# Altium schematic sheet USB3.SchDoc: USB3
size A3; Date: Not used; ApprovedBy: Not used; CheckedBy: Not used; Author: Not used; CompanyName: STMicroelectronics; DrawnBy: Not used; Engineer: Not used; Organization: Not used; Address1: Not used; Address2: Not used; Address3: Not used; Address4: Not used; DocumentNumber: Not used; Revision: Not used; SheetNumber: 13; SheetTotal: 18; CurrentTime: Not used; CurrentDate: Not used; Time: Not used; DocumentFullPathAndName: Not used; DocumentName: Not used; ModifiedDate: Not used; ImagePath: Not used; ProjectName: Not used; Application_BuildNumber: Not used
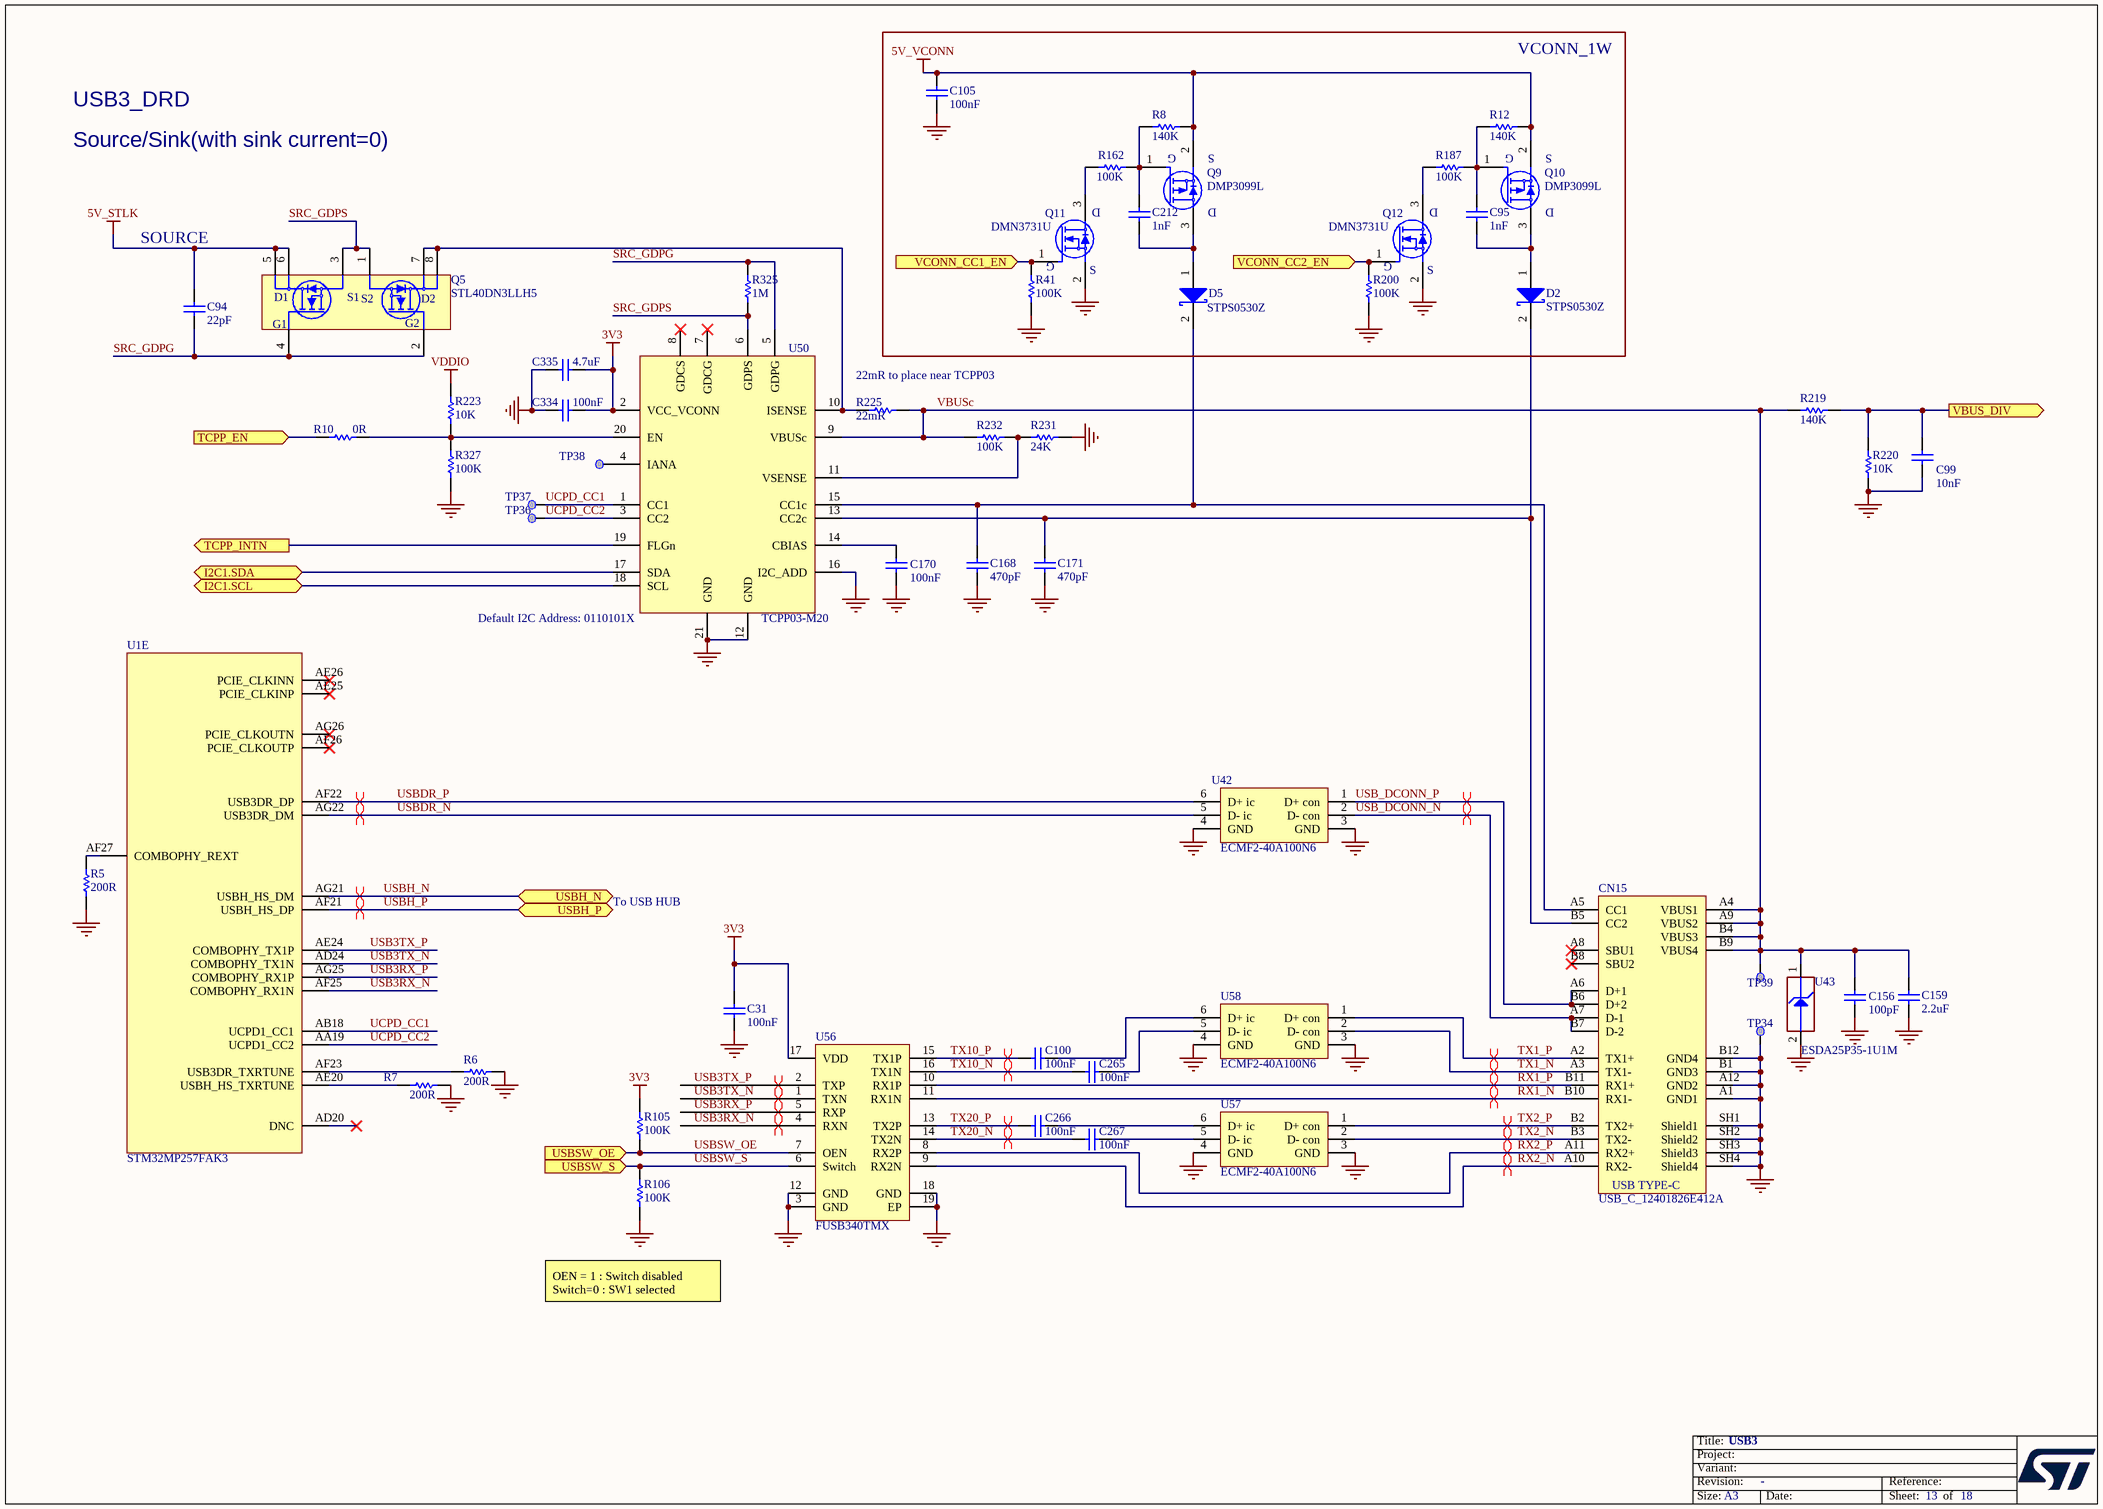
[diagram p0: USB3.SchDoc]

## Parts
C31  value 100nF  [C0402]  (hidden comment: Capacitor)
C94  value 22pF  [C0402]  (hidden comment: Capacitor)
C95  value 1nF  [C0402]  (hidden comment: Capacitor)
C99  value 10nF  [C0402]  (hidden comment: Capacitor)
C100  value 100nF  [C0201_H0P3]  (hidden comment: Capacitor)
C105  value 100nF  [C0402]  (hidden comment: Capacitor)
C156  value 100pF  [C0402]  (hidden comment: Capacitor)
C159  value 2.2uF  [C0805]  (hidden comment: Capacitor)
C168  value 470pF  [C0402]  (hidden comment: Capacitor)
C170  value 100nF  [C0603]  (hidden comment: Capacitor)
C171  value 470pF  [C0402]  (hidden comment: Capacitor)
C212  value 1nF  [C0402]  (hidden comment: Capacitor)
C265  value 100nF  [C0201_H0P3]  (hidden comment: Capacitor)
C266  value 100nF  [C0201_H0P3]  (hidden comment: Capacitor)
C267  value 100nF  [C0201_H0P3]  (hidden comment: Capacitor)
C334  value 100nF  [C0402]  (hidden comment: Capacitor)
C335  value 4.7uF  [C0402]  (hidden comment: Capacitor)
CN15  value USB_C_12401826E412A  [CON_USB-TYPEC_AMPHENOL_12401826E412A]  (hidden comment: USB_TYPE_C_Receptacle)
D2  value STPS0530Z  [DIO_SOD123_1A_2K_H1P45]  (hidden comment: SCHOTTKY_1A_2K)
D5  value STPS0530Z  [DIO_SOD123_1A_2K_H1P45]  (hidden comment: SCHOTTKY_1A_2K)
Q5  STL40DN3LLH5  [PowerFLAT_5x6]
Q9  value DMP3099L  [MOS_SOT23]  (hidden comment: MOSFET_P-CHANNEL)
Q10  value DMP3099L  [MOS_SOT23]  (hidden comment: MOSFET_P-CHANNEL)
Q11  value DMN3731U  [MOS_SOT23]  (hidden comment: MOSFET_N-CHANNEL)
Q12  value DMN3731U  [MOS_SOT23]  (hidden comment: MOSFET_N-CHANNEL)
R5  value 200R  [R0402]  (hidden comment: Resistor)
R6  value 200R  [R0402]  (hidden comment: Resistor)
R7  value 200R  [R0402]  (hidden comment: Resistor)
R8  value 140K  [R0402]  (hidden comment: Resistor)
R10  value 0R  [R0402]  (hidden comment: Resistor)
R12  value 140K  [R0402]  (hidden comment: Resistor)
R41  value 100K  [R0402]  (hidden comment: Resistor)
R105  value 100K  [R0402]  (hidden comment: Resistor)
R106  value 100K  [R0402]  (hidden comment: Resistor)
R162  value 100K  [R0402]  (hidden comment: Resistor)
R187  value 100K  [R0402]  (hidden comment: Resistor)
R200  value 100K  [R0402]  (hidden comment: Resistor)
R219  value 140K  [R0402]  (hidden comment: Resistor)
R220  value 10K  [R0402]  (hidden comment: Resistor)
R223  value 10K  [R0402]  (hidden comment: Resistor)
R225  value 22mR  [R0603]  (hidden comment: Resistor)
R231  value 24K  [R0402]  (hidden comment: Resistor)
R232  value 100K  [R0402]  (hidden comment: Resistor)
R325  value 1M  [R0402]  (hidden comment: Resistor)
R327  value 100K  [R0402]  (hidden comment: Resistor)
TP34  Test Point  [TP_SMD_1MM]  (value not drawn)  (no BOM)
TP36  Test Point  [TP_SMD_1MM]  (value not drawn)  (no BOM)
TP37  Test Point  [TP_SMD_1MM]  (value not drawn)  (no BOM)
TP38  Test Point  [TP_SMD_1MM]  (value not drawn)  (no BOM)
TP39  Test Point  [TP_SMD_1MM]  (value not drawn)  (no BOM)
U1  STM32MP257FAK3  [ICC_TFBGA424_14X14_P050_H1P20_CODE-B0A2]  (part E of 9)
U42  ECMF2-40A100N6  [ESD_UQFN-6L_1P45X1P4_P040]
U43  value ESDA25P35-1U1M  [ESD_QFN1610_2N_1K_2A]  (hidden comment: ESD-TRANSIL)
U50  TCPP03-M20  [ICC_QFN20-EPAD_4X4_P050]
U56  FUSB340TMX  [ICC_UQFN18-EPAD_2X2P80_P040]
U57  ECMF2-40A100N6  [ESD_UQFN-6L_1P45X1P4_P040]
U58  ECMF2-40A100N6  [ESD_UQFN-6L_1P45X1P4_P040]

## Blocks framed on the sheet
VCONN_1W: C95 C105 C212 D2 D5 Q9-Q12 R8 R12 R41 R162 R187 R200

## Ports
I2C1.SCL (bidir), I2C1.SDA (bidir), TCPP_EN (in), TCPP_INTN (out), USBH_N (bidir), USBH_P (bidir), USBSW_OE (in), USBSW_S (in), VBUS_DIV (out), VCONN_CC1_EN (in), VCONN_CC2_EN (in)

## Nets
3V3: C31.1 C334.1 C335.1 R105.2 U50.2(VCC_VCONN) U56.17(VDD)
5V_STLK: C94.2 Q5.5(D1) Q5.6(D1)
5V_VCONN: C105.1 Q9.2(S) Q10.2(S) R8.2 R12.2
GND: C31.2 C99.2 C105.2 C156.1 C159.1 C168.1 C170.1 C171.1 C334.2 C335.2 CN15.A1(GND1) CN15.A12(GND2) CN15.B1(GND3) CN15.B12(GND4) CN15.SH1(Shield1) CN15.SH2(Shield2) CN15.SH3(Shield3) CN15.SH4(Shield4) Q11.2(S) Q12.2(S) R5.1 R6.2 R7.2 R41.1 R106.1 R200.1 R220.1 R231.2 R327.1 TP34.1 U42.3(GND) U42.4(GND) U43.2(GND) U50.12(GND) U50.16(I2C_ADD) U50.21(GND) U56.3(GND) U56.12(GND) U56.18(GND) U56.19(EP) U57.3(GND) U57.4(GND) U58.3(GND) U58.4(GND)
VDDIO: R223.2
I2C1.SCL: U50.18(SCL) ; port I2C1.SCL
I2C1.SDA: U50.17(SDA) ; port I2C1.SDA
RX1_N: CN15.B10(RX1-) U56.11(RX1N)
RX1_P: CN15.B11(RX1+) U56.10(RX1P)
RX2_N: CN15.A10(RX2-) U56.9(RX2N)
RX2_P: CN15.A11(RX2+) U56.8(RX2P)
SRC_GDPG: C94.1 Q5.2(G2) Q5.4(G1) R325.2 U50.5(GDPG)
SRC_GDPS: Q5.1(S2) Q5.3(S1) R325.1 U50.6(GDPS)
TCPP_EN: R10.1 ; port TCPP_EN
TCPP_INTN: U50.19(FLGn) ; port TCPP_INTN
TX1_N: CN15.A3(TX1-) U58.2(D-_con)
TX1_P: CN15.A2(TX1+) U58.1(D+_con)
TX2_N: CN15.B3(TX2-) U57.2(D-_con)
TX2_P: CN15.B2(TX2+) U57.1(D+_con)
TX10_N: C265.1 U56.16(TX1N)
TX10_P: C100.1 U56.15(TX1P)
TX20_N: C267.1 U56.14(TX2N)
TX20_P: C266.1 U56.13(TX2P)
UCPD_CC1: TP37.1 U1.AB18(UCPD1_CC1) U50.1(CC1)
UCPD_CC2: TP36.1 U1.AA19(UCPD1_CC2) U50.3(CC2)
USB3RX_N: U1.AF25(COMBOPHY_RX1N) U56.4(RXN)
USB3RX_P: U1.AG25(COMBOPHY_RX1P) U56.5(RXP)
USB3TX_N: U1.AD24(COMBOPHY_TX1N) U56.1(TXN)
USB3TX_P: U1.AE24(COMBOPHY_TX1P) U56.2(TXP)
USB_DCONN_N: CN15.A7(D-1) CN15.B7(D-2) U42.2(D-_con)
USB_DCONN_P: CN15.A6(D+1) CN15.B6(D+2) U42.1(D+_con)
USBDR_N: U1.AG22(USB3DR_DM) U42.5(D-_ic)
USBDR_P: U1.AF22(USB3DR_DP) U42.6(D+_ic)
USBH_N: U1.AG21(USBH_HS_DM) ; port USBH_N
USBH_P: U1.AF21(USBH_HS_DP) ; port USBH_P
USBSW_OE: R105.1 U56.7(OEN) ; port USBSW_OE
USBSW_S: R106.2 U56.6(Switch) ; port USBSW_S
VBUS_DIV: C99.1 R219.1 R220.2 ; port VBUS_DIV
VBUSc: C156.2 C159.2 CN15.A4(VBUS1) CN15.A9(VBUS2) CN15.B4(VBUS3) CN15.B9(VBUS4) R219.2 R225.1 R232.1 TP39.1 U43.1(IO1) U50.9(VBUSc)
VCONN_CC1_EN: Q11.1(G) R41.2 ; port VCONN_CC1_EN
VCONN_CC2_EN: Q12.1(G) R200.2 ; port VCONN_CC2_EN
NetC95_1: C95.1 D2.1(A) Q10.3(D)
NetC95_2: C95.2 Q10.1(G) R12.1 R187.2
NetC100_2: C100.2 U58.6(D+_ic)
NetC168_2: C168.2 CN15.A5(CC1) D5.2(K) U50.15(CC1c)
NetC170_2: C170.2 U50.14(CBIAS)
NetC171_2: C171.2 CN15.B5(CC2) D2.2(K) U50.13(CC2c)
NetC212_1: C212.1 D5.1(A) Q9.3(D)
NetC212_2: C212.2 Q9.1(G) R8.1 R162.2
NetC265_2: C265.2 U58.5(D-_ic)
NetC266_2: C266.2 U57.6(D+_ic)
NetC267_2: C267.2 U57.5(D-_ic)
NetQ5_7: Q5.7(D2) Q5.8(D2) R225.2 U50.10(ISENSE)
NetQ11_3: Q11.3(D) R162.1
NetQ12_3: Q12.3(D) R187.1
NetR5_2: R5.2 U1.AF27(COMBOPHY_REXT)
NetR6_1: R6.1 U1.AF23(USB3DR_TXRTUNE)
NetR7_1: R7.1 U1.AE20(USBH_HS_TXRTUNE)
NetR10_2: R10.2 R223.1 R327.2 U50.20(EN)
NetR231_1: R231.1 R232.2 U50.11(VSENSE)
NetTP38_1: TP38.1 U50.4(IANA)

Not connected (* = marked no-connect by the designer): CN15 A8(SBU1)* B8(SBU2)*; U1 AD20(DNC)* AE25(PCIE_CLKINP)* AE26(PCIE_CLKINN)* AF26(PCIE_CLKOUTP)* AG26(PCIE_CLKOUTN)*; U50 7(GDCG)* 8(GDCS)*

## Layout directives
differential pair: RX1_N, RX1_P, RX2_N, RX2_P, TX1_N, TX1_P, TX2_N, TX2_P, TX10_N, TX10_P, TX20_N, TX20_P, USB3RX_N, USB3RX_P, USB3TX_N, USB3TX_P, USB_DCONN_N, USB_DCONN_P, USBDR_N, USBDR_P, USBH_N, USBH_P

## Notes on the sheet
- USB3_DRD
- Source/Sink(with sink current=0)
- SOURCE
- 22mR to place near TCPP03
- (near U50) Default I2C Address: 0110101X
- To USB HUB
- OEN = 1 : Switch disabled
  Switch=0 : SW1 selected
- Title:
- Project:
- Size:
- Revision:
- Variant:
- A3
- -
- Date:
- Reference:
- Sheet:
- of
- (in symbol MCD-03232) USB TYPE-C

## Library data of the parts
C31 C105 C334 = MCD-00006: Capacitor, MLCC, 100nF, 16V, X7R, +/-10%, 0402, T=0.5mm; Part_Preference: Recommended; Manufacturer: YAGEO; Manufacturer_Part_Number: CC0402KRX7R7BB104; Partial_Alternate_Internal_Part_Number: MCD-03299; Order_Code_RS: 616-9701; Component_Country_Of_Origin: China; Alternate_EMS: M; ID: 2474; ShowFields: YES; Internal_Part_Number: MCD-00006; Status: Released; Part_Type: Capacitor; Package: 0402; ComponentLink1URL: http://tunmcdsvn.tun.st.com/Component_Documentation_Library/Trunk/Capacitor/YAGEO_X7R_Series; Order_Code_Digikey: 311-1338-1-ND; Order_Code_Farnell: 9402047
C94 = MCD-01995: Capacitor, MLCC, 22pF, 50V, C0G, +/-5%, 0402, T=0.5mm; Part_Preference: Recommended; Manufacturer: TDK; Manufacturer_Part_Number: C1005NP01H220J050BA; Component_Country_Of_Origin: Unknown; ID: 4095; ShowFields: YES; Internal_Part_Number: MCD-01995; Status: Released; Part_Type: Capacitor; Package: 0402; ComponentLink1URL: http://tunmcdsvn.tun.st.com/Component_Documentation_Library/Trunk/Capacitor/TDK_C_Series; Order_Code_Digikey: 445-13793-1-ND; Order_Code_Farnell: 3416050RL; Order_Code_RS: N/A
C95 C212 = MCD-00198: Capacitor, MLCC, 1nF, 16V, X7R, +/-10%, 0402, T=0.5mm; Part_Preference: Recommended; Manufacturer: YAGEO; Manufacturer_Part_Number: CC0402KRX7R7BB102; Component_Country_Of_Origin: China; ShowFields: YES; ID: 2665; Internal_Part_Number: MCD-00198; Status: Released; Part_Type: Capacitor; Package: 0402; ComponentLink1URL: http://tunmcdsvn.tun.st.com/Component_Documentation_Library/Trunk/Capacitor/YAGEO_X7R_Series; Order_Code_Digikey: 311-1352-1-ND; Order_Code_Farnell: 2370642; Order_Code_RS: N/A
C99 = MCD-00011: Capacitor, MLCC, 10nF, 16V, X7R, 10%, 0402, T=0.5mm; Manufacturer_Part_Number: CC0402KRX7R7BB103; Manufacturer: YAGEO; Part_Preference: Recommended; Provided_By: SUBCO; Initial_Board_Reference: MB1274; Order_Code_RS: 669-8688; Internal_Part_Number: MCD-00011; Status: Released; Part_Type: Capacitor; Package: 0402; ComponentLink1Description: Datasheet; ComponentLink1URL: http://tunmcdsvn.tun.st.com/Component_Documentation_Library/Trunk/Capacitor/YAGEO_X7R_Series; ECCN_US: n/a; ECCN_EU: n/a; Alternate_Manufacturer: N/A; Alternate_Manufacturer_Part_Number: N/A; Order_Code_Digikey: 311-1042-1-ND; Order_Code_Farnell: 3019275
C100 C265-C267 = MCD-00697: Capacitor, MLCC, 100nF,10V, X5R, +/-10%, 0201, T=0.3mm; Part_Preference: Recommended; Manufacturer: TDK; Manufacturer_Part_Number: C0603X5R1A104K030BC; Component_Country_Of_Origin: Unknown; ID: 3046; ShowFields: YES; Internal_Part_Number: MCD-00697; Status: Released; Part_Type: Capacitor; Alternate_Manufacturer: N/A; Alternate_Manufacturer_Part_Number: N/A; Package: 0201; ComponentLink1URL: http://tunmcdsvn.tun.st.com/Component_Documentation_Library/Trunk/Capacitor/TDK_MCC_Series; Order_Code_Digikey: 445-7318-1-ND; Order_Code_Farnell: 2524957; Order_Code_RS: N/A
C156 = MCD-00205: Capacitor, MLCC, 100pF, 50V, NPO, +/-5%, 0402, T=0.5mm; Manufacturer_Part_Number: CC0402JRNPO9BN101; Manufacturer: YAGEO; Part_Preference: Recommended; Component_Country_Of_Origin: China; ID: 2658; ShowFields: YES; Internal_Part_Number: MCD-00205; Status: Released; Part_Type: Capacitor; Package: 0402; ComponentLink1URL: http://tunmcdsvn.tun.st.com/Component_Documentation_Library/Trunk/Capacitor/YAGEO_NP0_Series; Order_Code_Digikey: 311-1024-1-ND; Order_Code_Farnell: 3019226RL; Order_Code_RS: N/A
C159 = MCD-02372: Capacitor, MLCC, 2.2uF, 25V, X7R, +/-10%, 0805, T=1,25mm; Part_Preference: Recommended; Manufacturer: MURATA; Manufacturer_Part_Number: GRM21BR71E225KE11L; Component_Country_Of_Origin: Japan; ID: 4478; ShowFields: YES; Internal_Part_Number: MCD-02372; Status: Released; Part_Type: Capacitor; Package: 0805; ComponentLink1URL: http://tunmcdsvn.tun.st.com/Component_Documentation_Library/Trunk/Capacitor/MURATA_GRM_Series/GRM21BR71E225KE11; Order_Code_Digikey: 490-14467; Order_Code_Farnell: 2688538; Order_Code_RS: N/A
C168 C171 = MCD-00724: Capacitor, MLCC, 470pF, 50V, NPO, +/-5%, 0402, T=0.5mm; Manufacturer_Part_Number: CC0402JRNPO9BN471; Manufacturer: YAGEO; Part_Preference: Recommended; Component_Country_Of_Origin: China; Order_Code_RS: 199-2186; ID: 3023; ShowFields: YES; Internal_Part_Number: MCD-00724; Status: Released; Part_Type: Capacitor; Package: 0402; ComponentLink1URL: http://tunmcdsvn.tun.st.com/Component_Documentation_Library/Trunk/Capacitor/YAGEO_NP0_Series; Order_Code_Digikey: 311-1671-1-ND; Order_Code_Farnell: 3366416
C170 = MCD-01099: Capacitor, MLCC, 100nF, 50V, X7R, +/-10%, 0603, T=0.8mm; BMS_Part_Number: 9142278; Part_Preference: Recommended; Manufacturer: YAGEO; Manufacturer_Part_Number: CC0603KRX7R9BB104; Order_Code_RS: 669-8767; Component_Country_Of_Origin: China; ID: 3397; ShowFields: YES; Internal_Part_Number: MCD-01099; Status: Released; Part_Type: Capacitor; Package: 0603; ComponentLink1URL: http://tunmcdsvn.tun.st.com/Component_Documentation_Library/Trunk/Capacitor/YAGEO_X7R_Series; Order_Code_Digikey: 311-1344-1-ND; Order_Code_Farnell: 1362556; Partial_Alternate_Internal_Part_Number: MCD-0211
C335 = MCD-01356: Capacitor, MLCC, 4.7uF, 6V3, X5R, +/-20%, 0402, T=0.5mm; Part_Preference: Recommended; Manufacturer: MURATA; Manufacturer_Part_Number: GRM155R60J475ME47; Order_Code_RS: 814-5230; Component_Country_Of_Origin: Japan; ID: 3456; ShowFields: YES; Internal_Part_Number: MCD-01356; Status: Released; Part_Type: Capacitor; Package: 0402; ComponentLink1URL: http://tunmcdsvn.tun.st.com/Component_Documentation_Library/Trunk/Capacitor/MURATA_GRM_Series; Order_Code_Digikey: 490-5915-1-ND; Order_Code_Farnell: 2666407
CN15 = MCD-03232: USB_TypeC, 24 pins, RA, SMD, T=2.96mm (USB Certified 3.1); Part_Type: Connector; Part_Preference: Recommended; Manufacturer: AMPHENOL ICC; Manufacturer_Part_Number: 12401826E412A; Component_Country_Of_Origin: China°; ShowFields: YES; ID: 5348; Internal_Part_Number: MCD-03232; Status: Checked; ComponentLink1URL: http://tunmcdsvn.tun.st.com/Component_Documentation_Library/Trunk/Connector/AMPHEMOL_ICC_12401826E412A; Order_Code_Digikey: 12401826E412ATR-ND; Order_Code_Farnell: 3727763; Order_Code_RS: N/A
D2 D5 = MCD-03688: Diode, Schottky, 0V33, 0.5A , 30V, SOD123; Part_Preference: Recommended; Manufacturer: STMICROELECTRONICS; ShowFields: YES; ID: 5804; Internal_Part_Number: MCD-03688; Status: New; Part_Type: Diode; Manufacturer_Part_Number: STPS0530Z; Package: SOD123; ComponentLink1URL: http://tunmcdsvn.tun.st.com/Component_Documentation_Library/Trunk/Diode/STMICROELECTRONICS_STPS0530Z; Order_Code_Digikey: 497-16204-2-ND; Order_Code_Farnell: N/A; Order_Code_RS: N/A
Q5 = MCD-02152: MOSFET, Dual N-channel 30 V, 0.016 Ω typ., 40 A, STripFET™ H5 Power MOSFET; Part_Preference: Recommended; Part_Type: Transistor; Manufacturer: STMICROELECTRONICS; Manufacturer_HQ_COO: EU; Component_Country_Of_Origin: China; ID: 4252; ShowFields: YES; Internal_Part_Number: MCD-02152; Value: STL40DN3LLH5; Status: Released; Manufacturer_Part_Number: STL40DN3LLH5; Package: PowerFLAT 5x6; ComponentLink1URL: http://tunmcdsvn.tun.st.com/Component_Documentation_Library/Trunk/Transistor/STMICROELECTRONICS_STL40DN3LLH5; Order_Code_Digikey: N/A; Order_Code_Farnell: N/A; Order_Code_RS: N/A
Q9 Q10 = MCD-03690: Transistor, MOSFET, P-CH, 30V, 3.8A, SOT23; Part_Preference: Recommended; Manufacturer: DIODES INCORPORATED; ShowFields: YES; ID: 5806; Internal_Part_Number: MCD-03690; Status: New; Part_Type: Transistor; Manufacturer_Part_Number: DMP3099L; Package: SOT23; ComponentLink1URL: http://tunmcdsvn.tun.st.com/Component_Documentation_Library/Trunk/Transistor/DIODES_INCORPORATED_DMP3099L; Order_Code_Digikey: DMP3099L-13DITR-ND; Order_Code_Farnell: N/A; Order_Code_RS: N/A
Q11 Q12 = MCD-03691: Transistor, MOSFET, N-CH, 30V, 0.9A, SOT23; Part_Preference: Recommended; Manufacturer: DIODES INCORPORATED; Order_Code_RS: 206-0087; ShowFields: YES; ID: 5807; Internal_Part_Number: MCD-03691; Status: New; Part_Type: Transistor; Manufacturer_Part_Number: DMN3731U; ComponentLink1URL: http://tunmcdsvn.tun.st.com/Component_Documentation_Library/Trunk/Transistor/DIODES_INCORPORATED_DMN3731U; Order_Code_Digikey: 31-DMN3731U-7TR-ND; Order_Code_Farnell: 3943613
R5-R7 = MCD-00417: Resistor, 200R, 0402, +/-1%, 1/16W; Part_Preference: Recommended; Manufacturer: YAGEO; Manufacturer_Part_Number: RC0402FR-07200RL; Component_Country_Of_Origin: China; ID: 2860; ShowFields: YES; Internal_Part_Number: MCD-00417; Status: Released; Part_Type: Resistor; Package: 0402; ComponentLink1URL: http://tunmcdsvn.tun.st.com/Component_Documentation_Library/Trunk/Resistor/YAGEO_RC_L_Series; Order_Code_Digikey: 311-200LRCT-ND; Order_Code_Farnell: 1458756; Order_Code_RS: N/A
R8 R12 = MCD-02335: Resistor, 140K, 0402, +/-1%, 1/16W; Part_Preference: Recommended; Manufacturer: YAGEO; Manufacturer_Part_Number: RC0402FR-07140KL; Component_Country_Of_Origin: China; ShowFields: YES; ID: 4441; Internal_Part_Number: MCD-02335; Status: Checked; Part_Type: Resistor; Package: 0402; ComponentLink1URL: http://tunmcdsvn.tun.st.com/Component_Documentation_Library/Trunk/Resistor/YAGEO_RC_L_Series; Order_Code_Digikey: YAG2978CT-ND; Order_Code_Farnell: N/A; Order_Code_RS: N/A
R10 = MCD-00052: Resistor,0R,0402,5%,1/16W; Manufacturer_Part_Number: RC0402JR-070RL; Manufacturer: YAGEO; Part_Preference: Recommended; Order_Code_RS: 618-5804; Component_Country_Of_Origin: China; ID: 2540; ShowFields: YES; Internal_Part_Number: MCD-00052; Status: Released; Part_Type: Resistor; ComponentLink1Description: Part_Information; ComponentLink1URL: http://tunmcdsvn.tun.st.com/Component_Documentation_Library/Trunk/Resistor/YAGEO_RC_L_Series; Package: 0402; Order_Code_Digikey: 311-0.0JRCT-ND; Order_Code_Farnell: 9232516RL; Alternate_Manufacturer: N/A; Alternate_Manufacturer_Part_Number: N/A
R41 R162 R187 R200 = MCD-00059: Resistor, 100K, 0402, +/-1%, 1/16W; Part_Preference: Recommended; Manufacturer: YAGEO; Manufacturer_Part_Number: RC0402FR-07100KL; Partial_Alternate_Internal_Part_Number: MCD-03301; Component_Country_Of_Origin: China; Alternate_EMS: M; ShowFields: YES; ID: 2533; Internal_Part_Number: MCD-00059; Status: Released; Part_Type: Resistor; Package: 0402; ComponentLink1URL: http://tunmcdsvn.tun.st.com/Component_Documentation_Library/Trunk/Resistor/YAGEO_RC_L_Series; Order_Code_Digikey: 311-100KLRTR-ND; Order_Code_Farnell: 2421891; Order_Code_RS: N/A
R105 R106 = MCD-00059: Resistor,100K,0402,1%,1/16W; Part_Preference: Recommended; Manufacturer: YAGEO; Manufacturer_Part_Number: RC0402FR-07100KL; Alternate_Manufacturer_Part_Number: RT0402FRE07100KL; Partial_Alternate_Internal_Part_Number: MCD-03301; Alternate_EMS: M; Component_Country_Of_Origin: China; ID: 2533; ShowFields: YES; Internal_Part_Number: MCD-00059; Status: Released; Part_Type: Resistor; Alternate_Manufacturer: YAGEO; Package: 0402; ComponentLink1Description: Datasheet; ComponentLink1URL: http://tunmcdsvn.tun.st.com/Component_Documentation_Library/Trunk/Resistor/YAGEO_RC_L_Series; Order_Code_Digikey: 311-100KLRTR-ND; Order_Code_Farnell: 2421891; Order_Code_RS: N/A
R219 = MCD-02335: Resistor, 140K, 0402, +/-1%, 1/16W; Part_Preference: Recommended; Manufacturer: YAGEO; Manufacturer_Part_Number: RC0402FR-07140KL; Component_Country_Of_Origin: China; ID: 4441; ShowFields: YES; Internal_Part_Number: MCD-02335; Status: Checked; Part_Type: Resistor; Package: 0402; ComponentLink1URL: http://tunmcdsvn.tun.st.com/Component_Documentation_Library/Trunk/Resistor/YAGEO_RC_L_Series; Order_Code_Digikey: YAG2978CT-ND; Order_Code_Farnell: N/A; Order_Code_RS: N/A
R220 R223 = MCD-00053: Resistor, 10K, 0402, +/-1%, 1/16W; BMS_Part_Number: 9131590; Part_Preference: Recommended; Manufacturer: YAGEO; Manufacturer_Part_Number: RC0402FR-0710KL; Component_Country_Of_Origin: China; ID: 2539; ShowFields: YES; Internal_Part_Number: MCD-00053; Status: Released; Part_Type: Resistor; Package: 0402; ComponentLink1URL: http://tunmcdsvn.tun.st.com/Component_Documentation_Library/Trunk/Resistor/YAGEO_RC_L_Series; Order_Code_Digikey: 311-10.0KLRCT-ND; Order_Code_Farnell: 9239359; Order_Code_RS: N/A
R225 = MCD-02232: Resistor, 22mR, 0603, +/-1%, 1/3W; Part_Preference: Recommended; Manufacturer: PANASONIC; Manufacturer_Part_Number: ERJ-3BWFR022V; Order_Code_RS: 763-8671P; Component_Country_Of_Origin: Japan; ID: 4332; ShowFields: YES; Internal_Part_Number: MCD-02232; Status: Checked; Part_Type: Resistor; Package: 0603; ComponentLink1URL: http://tunmcdsvn.tun.st.com/Component_Documentation_Library/Trunk/Resistor/PANASONIC_ERJ_Series; Order_Code_Digikey: P17462CT-ND; Order_Code_Farnell: 1798578
R231 = MCD-00435: Resistor, 24K, 0402, +/-1%, 1/16W; Part_Preference: Recommended; Manufacturer: YAGEO; Manufacturer_Part_Number: RC0402FR-0724KL; Component_Country_Of_Origin: China; ShowFields: YES; ID: 2845; Internal_Part_Number: MCD-00435; Status: Released; Part_Type: Resistor; Package: 0402; ComponentLink1URL: http://tunmcdsvn.tun.st.com/Component_Documentation_Library/Trunk/Resistor/YAGEO_RC_L_Series; Order_Code_Digikey: 311-24KLRCT-ND; Order_Code_Farnell: N/A; Order_Code_RS: N/A
R232 R327 = MCD-02265: Resistor,100K,0402,0.5%,1/16W; Part_Preference: Recommended; Manufacturer: YAGEO; Manufacturer_Part_Number: RC0402DR-07100KL; Component_Country_Of_Origin: China; ShowFields: YES; ID: 4365; Internal_Part_Number: MCD-02265; Status: Released; Part_Type: Resistor; Package: 0402; Order_Code_Digikey: 13-RC0402DR-07100KLTR-ND; Order_Code_Farnell: N/A; Order_Code_RS: N/A
  R232: ComponentLink1URL: http://tunmcdsvn.tun.st.com/Component_Documentation_Library/Trunk/Resistor/YAGEO_RC0402_Series
  R327: ComponentLink1URL: http://tunmcdsvn.tun.st.com/Component_Datasheet_Library/Trunk/Resistors/Yageo_Resistor_RC0402-series
R325 = MCD-00182: Resistor, 1M, 0402, +/-1%, 1/16W; BMS_Part_Number: 9131778; Part_Preference: Recommended; Manufacturer: YAGEO; Manufacturer_Part_Number: RC0402FR-071ML; Order_Code_RS: 618-6194; Component_Country_Of_Origin: China; ShowFields: YES; ID: 2686; Internal_Part_Number: MCD-00182; Status: Released; Part_Type: Resistor; Package: 0402; ComponentLink1URL: http://tunmcdsvn.tun.st.com/Component_Documentation_Library/Trunk/Resistor/YAGEO_RC_L_Series; Order_Code_Digikey: 311-1.00MLRCT-ND; Order_Code_Farnell: 9239588
TP34 TP36-TP39 = MCD-00074: Test Point 1mm; Part_Type: Misc; Part_Preference: Recommended; ID: 2518; ShowFields: YES; Internal_Part_Number: MCD-00074; Status: Released; Manufacturer_Part_Number: n/a; Manufacturer: N/A; ComponentLink1URL: http://na; Order_Code_Digikey: N/A; Order_Code_Farnell: N/A; Order_Code_RS: N/A
U1 = MCD-03375: MPU , 2xCortex-A35@1.5GHz, Cortex-M33@400MHz, TFBGA 14x14, pitch 0.5, 648KB SRAM, With Crypto; Part_Type: IC; Part_Preference: Recommended; Manufacturer: STMICROELECTRONICS; Component_Country_Of_Origin: Unknown; ShowFields: YES; ID: 5491; Value: STM32MP257FAK3; Internal_Part_Number: MCD-03375; Status: Checked; Manufacturer_Part_Number: STM32MP257FAK3; Package: TFBGA; ComponentLink1URL: http://tunmcdsvn.tun.st.com/Component_Documentation_Library/Trunk/IC/STMICROELECTRONICS_STM32MP257FAK3; Order_Code_Digikey: N/A; Order_Code_Farnell: N/A; Order_Code_RS: N/A
U42 = MCD-03060: ESD protection & Common Filter High Speed serial Interfaces , 0.4 pitch; Part_Type: IC; Part_Preference: Recommended; Manufacturer: STMICROELECTRONICS; ShowFields: YES; ID: 5176; Component_Country_Of_Origin: China; ComponentLink1Description: Datasheet; ComponentLink1URL: http://tunmcdsvn.tun.st.com/Component_Documentation_Library/Trunk/IC/STMICROELECTRONICS_ECMF4-40A100N10; Internal_Part_Number: MCD-03060; Value: ECMF2-40A100N6; Status: Checked; Manufacturer_Part_Number: ECMF2-40A100N6; Package: uQFN-6; Order_Code_Digikey: 497-ECMF2-40A100N6; Order_Code_Farnell: 3993603; Order_Code_RS: N/A
U43 = MCD-01207: High power Transient voltage suppressor:25V/35A EOS and ESD transients protection.; BMS_Part_Number: 9179045; Part_Type: Diode; Part_Preference: Recommended; Manufacturer: STMICROELECTRONICS; Manufacturer_HQ_COO: EU; Component_Country_Of_Origin: China; ID: 3289; ShowFields: YES; Internal_Part_Number: MCD-01207; Status: Released; Manufacturer_Part_Number: ESDA25P35-1U1M; Package: QFN1610; ComponentLink1URL: http://tunmcdsvn.tun.st.com/Component_Documentation_Library/Trunk/Diode/STMICROELECTRONICS_ESDA25P35-1U1M; Order_Code_Digikey: N/A; Order_Code_Farnell: N/A; Order_Code_RS: N/A
U50 = MCD-02130: USB Type-C Port Protection for USB DRP Power Delivery, PPS compliant; Part_Preference: Recommended; Part_Type: IC; Manufacturer: STMICROELECTRONICS; Manufacturer_HQ_COO: EU; Component_Country_Of_Origin: Unknown; ID: 4230; ShowFields: YES; Internal_Part_Number: MCD-02130; Value: TCPP03-M20; Status: Released; Manufacturer_Part_Number: TCPP03-M20; Package: QFN-20L; ComponentLink1URL: http://tunmcdsvn.tun.st.com/Component_Documentation_Library/Trunk/IC/STMICROELECTRONICS_TCPP03-M20; Order_Code_Digikey: N/A; Order_Code_Farnell: N/A; Order_Code_RS: N/A
U56 = MCD-02300: Switch USB3.1 Superspeed 10 Gbps , Gen1 and Gen2; Part_Type: IC; Part_Preference: Recommended; Manufacturer: ON SEMICONDUCTOR; Component_Country_Of_Origin: Thailand; ID: 4400; ShowFields: YES; Internal_Part_Number: MCD-02300; Value: FUSB340TMX; Status: Checked; Manufacturer_Part_Number: FUSB340TMX; Alternate_Manufacturer: N/A; Alternate_Manufacturer_Part_Number: N/A; Package: QFN; ComponentLink1URL: http://tunmcdsvn.tun.st.com/Component_Documentation_Library/Trunk/IC/ON_SEMICONDUCTOR_FUSB340TMX; Order_Code_Digikey: FUSB340TMXTR-ND; Order_Code_Farnell: 3360109; Order_Code_RS: N/A
U57 U58 = MCD-03060: IC, ESD protection and Common Filter High Speed serial Interfaces, 10.7 GHz; Part_Preference: Recommended; Manufacturer: STMICROELECTRONICS; Component_Country_Of_Origin: China; ShowFields: YES; ID: 5176; ComponentLink1Description: Datasheet; ComponentLink1URL: http://tunmcdsvn.tun.st.com/Component_Documentation_Library/Trunk/IC/STMICROELECTRONICS_ECMF4-40A100N10; Internal_Part_Number: MCD-03060; Value: ECMF2-40A100N6; Status: Released; Part_Type: IC; Manufacturer_Part_Number: ECMF2-40A100N6; Package: uQFN-6; Order_Code_Digikey: 497-ECMF2-40A100N6; Order_Code_Farnell: 3993603; Order_Code_RS: N/A